# EAGLE design xio (EAGLE 5.11)
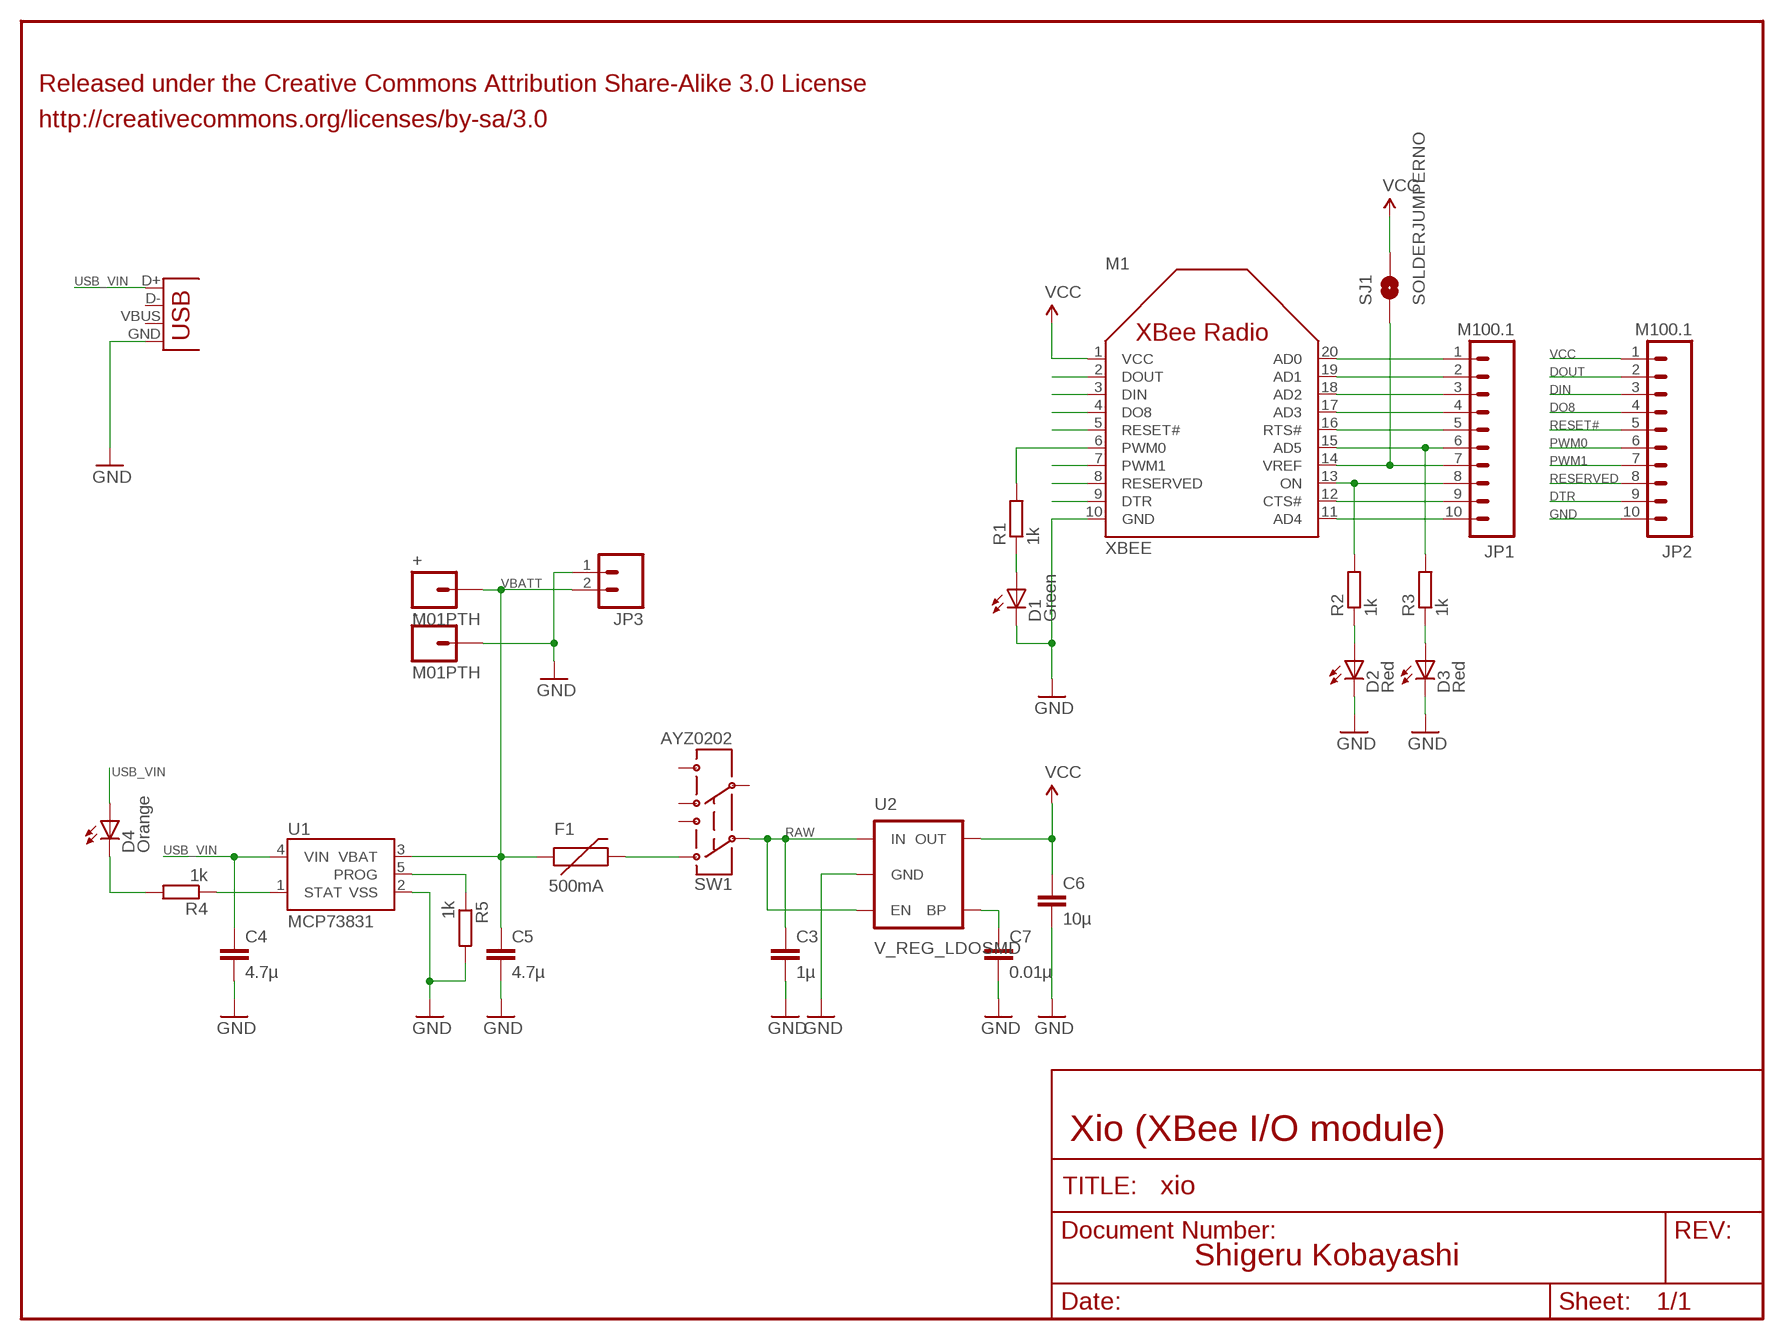
[diagram p0: schematic, sheet 1]

## Parts
+  M01PTH  [1X01]
-  M01PTH  [1X01]
C3  1µ  CAP0603-CAP  [0603-CAP]
C4  4.7µ  CAP0805  [0805]
C5  4.7µ  CAP0805  [0805]
C6  10µ  CAP0805  [0805]
C7  0.01µ  CAP0603-CAP  [0603-CAP]
D1  Green  LEDCHIPLED_0805  [CHIPLED_0805]
D2  Red  LEDCHIPLED_0805  [CHIPLED_0805]
D3  Red  LEDCHIPLED_0805  [CHIPLED_0805]
D4  Orange  LEDCHIPLED_0805  [CHIPLED_0805]
F1  500mA  PTCSMD  [PTC-1206]
JP1  M100.1  M10"  [1X10]
JP2  M100.1  M10"  [1X10]
JP3  M02-JST-2MM-SMT  [JST-2-SMD]
M1  XBEE  [XBEE]
R1  1k  R-EU_R0603  [R0603]
R2  1k  R-EU_R0603  [R0603]
R3  1k  R-EU_R0603  [R0603]
R4  1k  R-EU_R0603  [R0603]
R5  1k  R-EU_R0603  [R0603]
SJ1  SOLDERJUMPERNO  [SJ_2S-NO]
SW1  AYZ0202  [AYZ0202]
U1  MCP73831  [SOT23-5]
U2  V_REG_LDOSMD  [SOT23-5]
X1  USB-MICROB  [USB-MICROB]

## Nets
AD3: JP1.4 M1.17(AD3)
AD4: JP1.10 M1.11(AD4)
DIN: JP2.3 M1.3(DIN)
DO8: JP2.4 M1.4(DO8)
DOUT: JP2.2 M1.2(DOUT)
DTR: JP2.9 M1.9(DTR)
GND: -.1 C3.2 C4.2 C5.2 C6.2 C7.2 D1.C D2.C D3.C JP2.10 JP3.1 M1.10(GND) R5.2 U1.2(VSS) U2.2(GND) X1.GND
N$1: JP1.8 M1.13(ON) R2.2
N$2: JP1.1 M1.20(AD0)
N$3: D1.A R1.1
N$4: C7.1 U2.4(BP)
N$5: R5.1 U1.5(PROG)
N$6: D2.A R2.1
N$7: JP1.2 M1.19(AD1)
N$8: D4.C R4.2
N$9: F1.2 SW1.3
N$10: JP1.3 M1.18(AD2)
N$11: R4.1 U1.1(STAT)
N$13: JP1.5 M1.16(RTS#)
N$14: JP1.6 M1.15(AD5) R3.2
N$15: JP1.7 M1.14(VREF) SJ1.1
N$16: JP1.9 M1.12(CTS#)
N$18: D3.A R3.1
PWM0: JP2.6 M1.6(PWM0) R1.2
PWM1: JP2.7 M1.7(PWM1)
RAW: C3.1 SW1.2 U2.1(IN) U2.3(EN)
RESERVED: JP2.8 M1.8(RESERVED)
RESET#: JP2.5 M1.5(RESET#)
USB_VIN: C4.1 D4.A U1.4(VIN) X1.D+
VBATT: +.1 C5.1 F1.1 JP3.2 U1.3(VBAT)
VCC [VCC]: C6.1 JP2.1 M1.1(VCC) SJ1.2 U2.5(OUT)
Unconnected: SW1.1 SW1.4 SW1.5 SW1.6 X1.D- X1.VBUS

## Notes on the sheet
- Released under the Creative Commons Attribution Share-Alike 3.0 License
- http://creativecommons.org/licenses/by-sa/3.0
- Xio (XBee I/O module)
- Shigeru Kobayashi

## Library data of the parts
+ - = SparkFun:M01: Header 1 Standard 1-pin 0.1" header. Use with straight break away headers (SKU : PRT-00116), right angle break away headers (PRT-00553), swiss pins (PRT-00743), machine pins (PRT-00117), and female headers (PRT-00115).
C3-C7 = SparkFun:CAP: Capacitor Standard 0603 ceramic capacitor, and 0.1" leaded capacitor.
D1-D4 = led:LED: LED OSRAM: - CHIPLED LG R971, LG N971, LY N971, LG Q971, LY Q971, LO R971, LY R971 LH N974, LH R974 LS Q976, LO Q976, LY Q976 LO Q996 - Hyper CHIPLED LW Q18S LB Q993, LB Q99A, LB R99A - SideLED LS A670, LO A670, LY A670, LG A670, LP A670 LB A673, LV A673, LT A673, LW A673 LH A674 LY A675 LS A676, LA A676, LO A676, LY A676, LW A676 LS A679, LY A679, LG A679 - Hyper Micro SIDELED® LS Y876, LA Y876, LO Y876, LY Y876 LT Y87S - SmartLED LW L88C, LW L88S LB L89C, LB L89S, LG L890 LS L89K, LO L89K, LY L89K LS L896, LA L896, LO L896, LY L896 - TOPLED LS T670, LO T670, LY T670, LG T670, LP T670 LSG T670, LSP T670, LSY T670, LOP T670, LYG T670 LG T671, LOG T671, LSG T671 LB T673, LV T673, LT T673, LW T673 LH T674 LS T676, LA T676, LO T676, LY T676, LB T676, LH T676, LSB T676, LW T676 LB T67C, LV T67C, LT T67C, LS T67K, LO T67K, LY T67K, LW E67C LS E67B, LA E67B, LO E67B, LY E67B, LB E67C, LV E67C, LT E67C LW T67C LS T679, LY T679, LG T679 LS T770, LO T770, LY T770, LG T770, LP T770 LB T773, LV T773, LT T773, LW T773 LH T774 LS E675, LA E675, LY E675, LS T675 LS T776, LA T776, LO T776, LY T776, LB T776 LHGB T686 LT T68C, LB T68C - Hyper Mini TOPLED® LB M676 - Mini TOPLED Santana® LG M470 LS M47K, LO M47K, LY M47K Source: http://www.osram.convergy.de LUXEON: - LUMILED® LXK2-PW12-R00, LXK2-PW12-S00, LXK2-PW14-U00, LXK2-PW14-V00 LXK2-PM12-R00, LXK2-PM12-S00, LXK2-PM14-U00 LXK2-PE12-Q00, LXK2-PE12-R00, LXK2-PE12-S00, LXK2-PE14-T00, LXK2-PE14-U00 LXK2-PB12-K00, LXK2-PB12-L00, LXK2-PB12-M00, LXK2-PB14-N00, LXK2-PB14-P00, LXK2-PB14-Q00 LXK2-PR12-L00, LXK2-PR12-M00, LXK2-PR14-Q00, LXK2-PR14-R00 LXK2-PD12-Q00, LXK2-PD12-R00, LXK2-PD12-S00 LXK2-PH12-R00, LXK2-PH12-S00 LXK2-PL12-P00, LXK2-PL12-Q00, LXK2-PL12-R00 Source: www.luxeon.com KINGBRIGHT: KA-3528ASYC Source: www.kingbright.com
F1 = SparkFun:PTC: Resettable Fuse PTC Resettable Fuse. Spark Fun Electronics SKU : COM-08357
JP1 JP2 = SparkFun:M10: Header 10 Standard 10-pin 0.1" header. Use with straight break away headers (SKU : PRT-00116), right angle break away headers (PRT-00553), swiss pins (PRT-00743), machine pins (PRT-00117), and female headers (PRT-00115).
JP3 = SparkFun:M02: Header 2 Standard 2-pin 0.1" header. Use with straight break away headers (SKU : PRT-00116), right angle break away headers (PRT-00553), swiss pins (PRT-00743), machine pins (PRT-00117), and female headers (PRT-00115). Molex polarized connector foot print use with SKU : PRT-08233 with associated crimp pins and housings.
M1 = digi_xbee:XBEE
R1-R5 = rcl:R-EU_: RESISTOR, European symbol
SJ1 = SparkFun:SOLDERJUMPER: Solder Jumper Standard SMD solder jumper. Used to automate production. Two varients : Normally Open and Normally Closed are the same, but have different paste layers. NC will have a large amount of paste and should jumper during reflow.
SW1 = SparkFun:AYZ0202: SPDT Slide Switch Simple SMD single-pull double-throw slide switch. Good for less than 350mA power switch, switching UARTs between devices, etc. Spark Fun Electronics SKU : COM-00597
U1 = SparkFun:MCP73831: Microchip's MCP73831 Miniature single cell, fully integrated Li-Ion, Li-polymer charge management controller http://ww1.microchip.com/downloads/en/DeviceDoc/21984a.pdf
U2 = SparkFun:V_REG_LDO: Voltage Regulator LDO Standard 150mA LDO voltage regulator in SOT-23 layout. Micrel part MIC5205. BP (by-pass) pin is used to lower output noise with 470pF cap.
X1 = SparkFun:USB: USB Connectors USB-B-PTH is fully proven SKU : PRT-00139 USB-miniB is fully proven SKU : PRT-00587 USB-A-PCB is untested. USB-A-H is throughly reviewed, but untested. Spark Fun Electronics SKU : PRT-00437 USB-B-SMT is throughly reviewed, but untested. Needs silkscreen touching up. USB-A-S has not been used/tested USB-MB-H has not been used/tested

## Net classes
0 Default: width 0.203 mm
1 VCC: width 0.381 mm
2 LEDPower: width 0.203 mm
3 ButtonSignal: width 0.203 mm

## Board
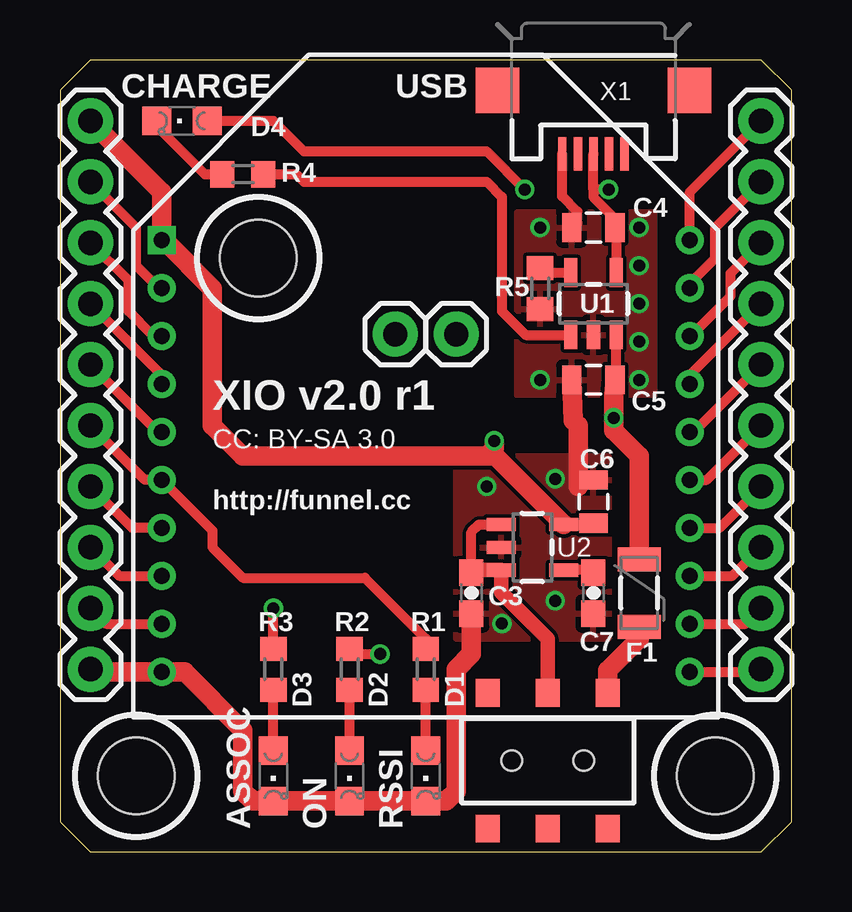
[diagram p1: board, top side]
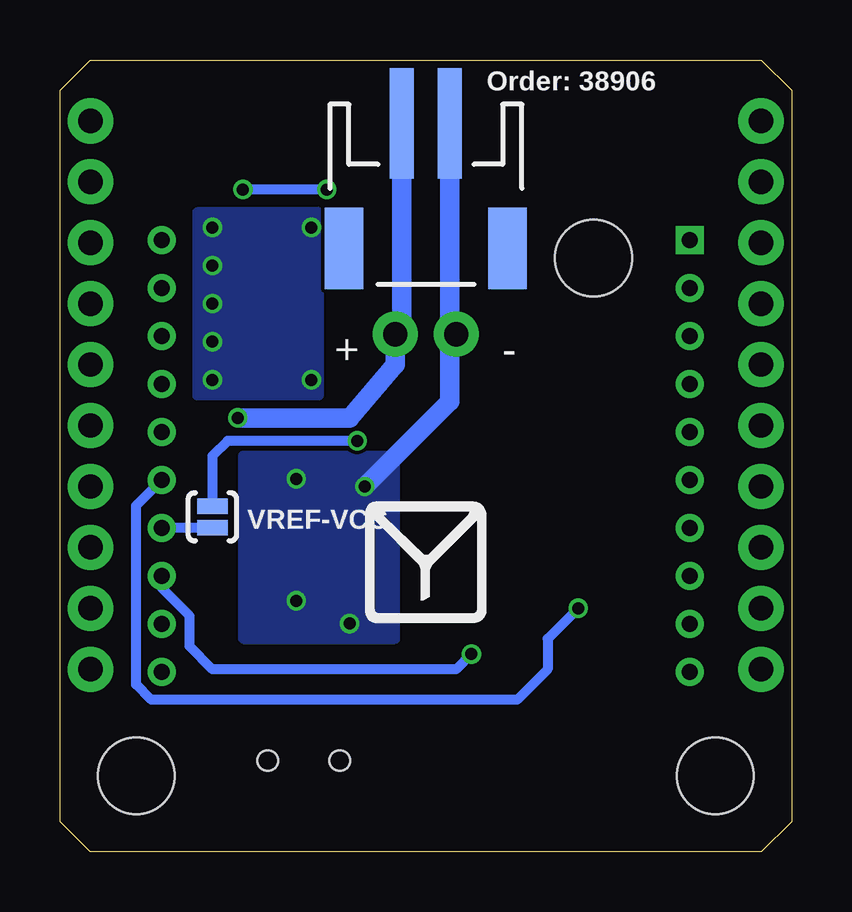
[diagram p2: board, bottom side, seen from below]

Size 30.48 x 33.02 mm. Coordinates in mm from the lower left corner, seen from the top.
Outline: 30.48,31.75 29.21,33.02 1.27,33.02 0,31.75 0,1.27 1.27,0 29.21,0 30.48,1.27 30.48,31.75
Copper layers (1*16): Top 0.035mm / dielectric 1.5mm / Bottom 0.035mm
Design rules "Fusion_eagle_rule_v1.1": minimum track width 6mil, minimum drill 12mil, track to track 6mil, track to pad 6mil, pad to pad 6mil, via to via 6mil, smd to smd 0mil, copper to edge 10mil, drill to drill 10mil, minimum pad ring 10mil, minimum via ring 6mil, stop-mask expansion 2mil, vias tented up to drill 100mil, thermal gap 10mil
Holes 3.2 mm at 3.17,3.17 27.3,3.17 8.26,24.77

### Footprints (pad centres in the part's own frame; a part is rotated, then mirrored left to right if it is on the bottom)
1X01 = drill 1.016 pad 1.88 round: 1 0,0
0603-CAP = smd 1.1 x 1: 1 -0.85,0; 2 0.85,0
0805 = smd 0.8 x 1.2: 1 -0.9,0; 2 0.9,0
CHIPLED_0805 = smd 1.2 x 1.2: A 0,-1.05; C 0,1.05
PTC-1206 = smd 1 x 1.8: 1 -1.4,0; 2 1.4,0
1X10 = drill 1.016 pad 1.88 round: 1 0,0; 2 2.54,0; 3 5.08,0; 4 7.62,0; 5 10.16,0; 6 12.7,0; 7 15.24,0; 8 17.78,0; 9 20.32,0; 10 22.86,0
JST-2-SMD = smd 1 x 4.6: 1 -1,-3.7; 2 1,-3.7 | smd 1.6 x 3.4: NC1 -3.4,1.5; NC2 3.4,1.5
XBEE = drill 0.66 square: 1 -11,9 | drill 0.66 round: 2 -11,7; 3 -11,5; 4 -11,3; 5 -11,1; 6 -11,-1; 7 -11,-3; 8 -11,-5; 9 -11,-7; 10 -11,-9; 11 11,-9; 12 11,-7; 13 11,-5; 14 11,-3; 15 11,-1; 16 11,1; 17 11,3; 18 11,5; 19 11,7; 20 11,9
R0603 = smd 1 x 1.1: 1 -0.85,0; 2 0.85,0
SJ_2S-NO = smd 0.635 x 1.27: 1 -0.45,0; 2 0.45,0
AYZ0202 = smd 1 x 1.15: 1 -2.5,2.825; 2 0,2.825; 3 2.5,2.825; 4 -2.5,-2.825; 5 0,-2.825; 6 2.5,-2.825 | hole 0.85: 1.5,0; -1.5,0
SOT23-5 = smd 0.55 x 1.2: 1 -0.95,-1.3; 2 0,-1.3; 3 0.95,-1.3; 4 0.95,1.3; 5 -0.95,1.3
USB-MICROB = smd 0.35 x 1.4: D+ 0,2.65; D- -0.65,2.65; GND 1.3,2.65; ID 0.65,2.65; VBUS -1.3,2.65 | smd 1.8 x 1.9: MT1 -4,0; MT2 4,0

### Placement (x,y rotation side)
+  16.51,21.59 0 top
-  13.97,21.59 0 top
C3  17.14,10.79 270 top
C4  22.23,26.04 180 top
C5  22.23,19.68 180 top
C6  22.23,14.61 90 top
C7  22.23,10.79 270 top
D1  15.24,3.17 180 top
D2  12.06,3.17 180 top
D3  8.89,3.17 180 top
D4  5.08,30.48 90 top
F1  24.13,10.79 270 top
JP1  29.21,30.48 270 top
JP2  1.27,30.48 270 top
JP3  15.24,26.67 180 bottom
M1  15.24,16.51 0 top
R1  15.24,7.62 90 top
R2  12.06,7.62 90 top
R3  8.89,7.62 90 top
R4  7.62,28.26 180 top
R5  20,23.5 270 top
SJ1  24.13,13.97 90 bottom
SW1  20.32,3.81 0 top
U1  22.23,22.86 0 top
U2  19.68,12.7 270 top
U$1  [FUNNEL_LOGO_TOP_SMALL]  15.24,12.06 0 bottom
X1  22.23,31.75 180 top

### Tracks (layer width: path | path; a pad name or v marks a point on that pad's centre or on a via)
AD3
  Top 0.406: M1.17 26.24,19.89 JP1.4
AD4
  Top 0.406: M1.11 29.1,7.51 JP1.10
DIN
  Top 0.406: M1.3 3.89,21.51 2.86,22.54 2.86,23.81 JP2.3
DO8
  Top 0.406: M1.4 4.24,19.89 JP2.4
DOUT
  Top 0.406: M1.2 4.11,23.51 3.17,24.45 3.17,26.04 JP2.2
DTR
  Top 0.406: M1.9 1.92,9.51 JP2.9
GND  (via drill 0.5)
  Top 0.305: C4.2 21.56,26.22
  Top 0.406: C6.2 21.8,15.46 21.59,15.24 | X1.GND 20.93,27.34 21.56,26.7 21.56,26.22
  Top 0.813: C5.2 21.38,18 21.59,17.78 21.59,15.24 | JP2.10 1.38,7.51 M1.10 5.19,7.51 7.62,5.08 7.62,2.54 8.04,2.12 D3.C D2.C D1.C 16.09,2.12 16.51,2.54 16.51,7.62 17.14,8.26 C3.2
  Bottom 0.813: 14.24,21.86 JP3.1 | 14.24,21.86 -.1 | 14.24,21.86 14.24,18.78 v17.78,15.24
  other vias: 20.64,15.56 20.64,10.48 18.41,9.53 20,26.04 20,19.68 24.13,19.68 24.13,22.86 24.13,26.04 24.13,24.45 24.13,21.27
  pour Top: 19.05,26.67 24.77,26.67 24.77,19.05 19.05,19.05
  pour Top: 16.51,16.51 22.86,16.51 22.86,8.89 16.51,8.89
  pour Bottom: 16.51,16.51 22.86,16.51 22.86,8.89 16.51,8.89
  pour Bottom: 19.68,26.67 24.77,26.67 24.77,19.05 19.68,19.05
N$1  (via drill 0.5)
  Top 0.406: M1.13 28.02,11.51 JP1.8 | v13.34,8.26 12.28,8.26 R2.2
  Bottom 0.406: M1.13 26.24,11 25.08,9.84 25.08,8.57 24.13,7.62 13.97,7.62 v13.34,8.26
N$2
  Top 0.406: M1.20 26.24,27.51 JP1.1
N$3
  Top 0.406: D1.A R1.1
N$4
  Top 0.406: U2.4 22.12,11.75 C7.1
N$5
  Top 0.406: U1.5 20.5,24.16 R5.1
N$6
  Top 0.406: D2.A R2.1
N$7
  Top 0.406: M1.19 26.24,23.7 27.3,24.77 27.3,26.04 JP1.2
N$8
  Top 0.406: D4.C 4.03,30.26 6.03,28.26 R4.2
N$9
  Top 0.813: SW1.3 22.82,7.58 24.13,8.89 F1.2
N$10
  Top 0.406: M1.18 26.27,21.51 27.94,23.18 27.94,24.13 JP1.3
N$11
  Top 0.406: U1.1 19.4,21.56 18.41,22.54 18.41,27.3 17.78,27.94 10.16,27.94 9.84,28.26 R4.1
N$13
  Top 0.406: M1.16 26.4,17.51 JP1.5
N$14  (via drill 0.5)
  Top 0.406: M1.15 26.94,15.51 JP1.6 | R3.2 v8.89,10.16
  Bottom 0.406: 26.24,15.67 M1.15 27.3,14.45 27.3,6.99 26.67,6.35 11.43,6.35 10.16,7.62 10.16,8.89 v8.89,10.16
N$15
  Top 0.406: M1.14 27.48,13.51 JP1.7
  Bottom 0.406: M1.14 SJ1.1
N$16
  Top 0.406: M1.12 28.56,9.51 JP1.9
N$18
  Top 0.406: D3.A R3.1
PWM0
  Top 0.406: JP2.6 3.54,15.51 M1.6 6.35,13.4 6.35,12.7 7.62,11.43 12.7,11.43 15.24,8.89 R1.2
PWM1
  Top 0.406: M1.7 3,13.51 JP2.7
RAW
  Top 0.406: 17.25,11.75 C3.1 17.14,13.34 17.46,13.65 U2.1
  Top 0.61: SW1.2 20.32,8.89 18.39,10.82 U2.3 17.25,11.75
RESERVED
  Top 0.406: M1.8 2.46,11.51 JP2.8
RESET#
  Top 0.406: M1.5 4.08,17.51 JP2.5
USB_VIN  (via drill 0.5)
  Top 0.305: 22.86,26.25 C4.1 23.18,25.93
  Top 0.406: 23.18,25.93 U1.4 | D4.A 8.89,30.48 10.16,29.21 17.78,29.21 v19.37,27.62 | 22.23,27.62 22.23,27.3 23.07,26.45 C4.1 | 22.23,27.62 X1.D+ | v22.86,27.62 22.23,27.62
  Bottom 0.406: v19.37,27.62 v22.86,27.62
VBATT  (via drill 0.5)
  Top 0.305: C5.1 23.18,19.79
  Top 0.406: 23.18,19.79 U1.3
  Top 0.813: C5.1 23.07,19.05 v23.07,18.1 23.07,17.57 24.13,16.51 F1.1
  Bottom 0.813: JP3.2 16.24,21.86 +.1 16.51,20.32 18.41,18.1 v23.07,18.1
VCC  (via drill 0.5)
  Top 0.406: U2.5 22.12,13.65 C6.1
  Top 0.813: JP2.1 4.24,27.51 M1.1 4.33,25.51 6.35,23.5 6.35,17.78 7.62,16.51 17.78,16.51 | 17.78,16.51 18.12,16.51 U2.5 | v18.1,17.14 18.1,16.83 17.78,16.51
  Bottom 0.406: SJ1.2 24.13,16.51 23.5,17.14 v18.1,17.14

### Text on the board
tPlace: CHARGE | USB | XIO v2.0 r1 | CC: BY-SA 3.0 | http://funnel.cc | ASSOC | ON | RSSI
bPlace: Order: 38906
bNames: VREF-VCC